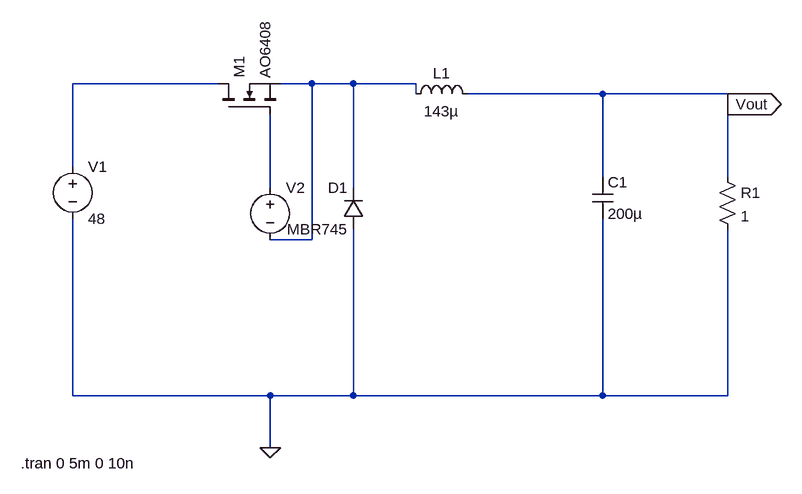
[diagram p0: schematic buck_ideal.asc]
buck_ideal.asc, the LTspice schematic file:
Version 4.1
SHEET 1 1084 680
WIRE 240 -304 16 -304
WIRE 384 -304 336 -304
WIRE 448 -304 384 -304
WIRE 544 -304 448 -304
WIRE 544 -288 544 -304
WIRE 832 -288 624 -288
WIRE 1024 -288 832 -288
WIRE 1024 -272 1024 -288
WIRE 16 -176 16 -304
WIRE 832 -160 832 -288
WIRE 1024 -160 1024 -272
WIRE 320 -144 320 -256
WIRE 448 -144 448 -304
WIRE 384 -64 384 -304
WIRE 384 -64 320 -64
WIRE 16 176 16 -96
WIRE 320 176 16 176
WIRE 448 176 448 -80
WIRE 448 176 320 176
WIRE 832 176 832 -96
WIRE 832 176 448 176
WIRE 1024 176 1024 -80
WIRE 1024 176 832 176
WIRE 320 256 320 176
FLAG 1024 -272 Vout
IOPIN 1024 -272 Out
FLAG 320 256 0
DATAFLAG 16 -304 ""
SYMBOL voltage 16 -192 R0
WINDOW 123 0 0 Left 0
WINDOW 39 0 0 Left 0
SYMATTR InstName V1
SYMATTR Value 48
SYMBOL ind 528 -272 R270
WINDOW 0 32 56 VTop 2
WINDOW 3 5 56 VBottom 2
SYMATTR InstName L1
SYMATTR Value 143µ
SYMATTR SpiceLine Rser=1m
SYMBOL cap 816 -160 R0
SYMATTR InstName C1
SYMATTR Value 200µ
SYMBOL res 1008 -176 R0
SYMATTR InstName R1
SYMATTR Value 1
SYMBOL voltage 320 -160 R0
WINDOW 3 24 44 Invisible 2
WINDOW 123 0 0 Left 0
WINDOW 39 0 0 Left 0
SYMATTR InstName V2
SYMATTR Value PULSE(0 12 0 1n 1n 10u 40u)
SYMBOL nmos 240 -256 R270
SYMATTR InstName M1
SYMATTR Value AO6408
SYMBOL diode 464 -80 R180
WINDOW 0 24 64 Left 2
WINDOW 3 24 0 Left 2
SYMATTR InstName D1
SYMATTR Value MBR745
TEXT -64 280 Left 2 !.tran 0 5m 0 10n

The netlist it stands for:
* buck_ideal.asc
V1 N001 0 48
L1 N002 Vout 143µ Rser=1m
C1 Vout 0 200µ
R1 Vout 0 1
V2 N003 N002 PULSE(0 12 0 1n 1n 10u 40u)
M1 N001 N003 N002 N002 AO6408
D1 0 N002 MBR745
.model D D
.lib standard.dio
.model NMOS NMOS
.model PMOS PMOS
.lib standard.mos
.tran 0 5m 0 10n
.backanno
.end